# EAGLE design clock_src (EAGLE 7.7.0)
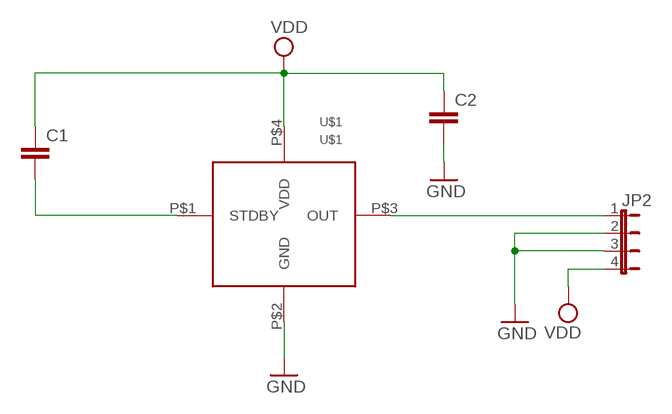
[diagram p0: schematic, sheet 1]

## Parts
C1  C-EUC0603  [C0603]
C2  C-EUC0603  [C0603]
JP2  JP4E  [JP4]
U$1  ASFLMB-24525  [ASFLMB-24525]

## Nets
GND: C2.2 JP2.2 JP2.3 U$1.P$2(GND)
N$1: JP2.1 U$1.P$3(OUT)
N$2: C1.2 U$1.P$1(STDBY)
VDD: C1.1 C2.1 JP2.4 U$1.P$4(VDD)

## Library data of the parts
C1 C2 = resistor:C-EU: CAPACITOR, European symbol
JP2 = jumper:JP4E: JUMPER
U$1 = FM_transmitter:ASFLMB-24525

## Board
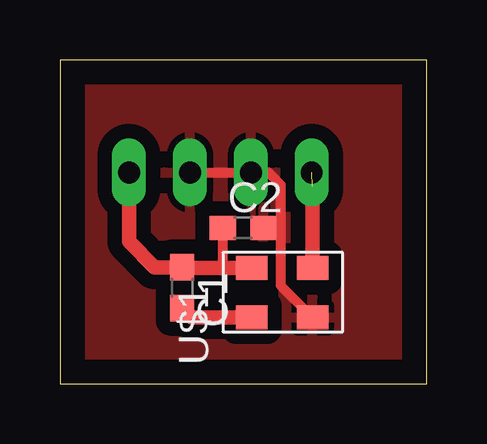
[diagram p1: board, top side]
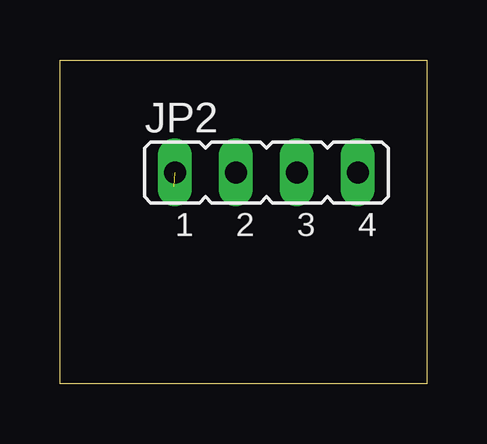
[diagram p2: board, bottom side, seen from below]

Size 15.3 x 13.5 mm. Coordinates in mm from the lower left corner, seen from the top.
Outline: 0,0 15.3,0 15.3,13.5 0,13.5 0,0
Copper layers (1*16): Top 0.035mm / dielectric 1.5mm / Bottom 0.035mm
Design rules "default": minimum track width 10mil, minimum drill 24mil, track to track 8mil, track to pad 8mil, pad to pad 8mil, via to via 8mil, smd to smd 8mil, copper to edge 40mil, drill to drill 8mil, minimum pad ring 10mil, minimum via ring 8mil, stop-mask expansion 4mil, vias tented up to drill 0mil, thermal gap 10mil

### Footprints (pad centres in the part's own frame; a part is rotated, then mirrored left to right if it is on the bottom)
C0603 = smd 1.1 x 1: 1 -0.85,0; 2 0.85,0
JP4 = drill 0.914 long: 1 -3.81,0; 2 -1.27,0; 3 1.27,0; 4 3.81,0
ASFLMB-24525 = smd 1.3 x 1: P$1 0.2,0; P$2 2.74,0; P$3 2.74,2.07; P$4 0.2,2.07

### Placement (x,y rotation side)
C1  5.1,4 270 top
C2  7.64,6.5 0 top
JP2  6.69,8.81 0 bottom
U$1  7.8,2.76 0 top

### Tracks (layer width: path | path; a pad name or v marks a point on that pad's centre or on a via)
GND
  Top 0.406: 9.2,6.5 9.2,8.3 8.69,8.81 JP2.2 JP2.3 | 9.2,6.5 9.2,4.1 U$1.P$2 | C2.2 9.2,6.5
  pour Top (isolate 0.6): 14.2,12.7 0.5,12.7 0.5,0.7 14.2,0.7
N$1  (1 unrouted)
  Top 0.61: 10.54,8.21 U$1.P$3
N$2
  Top 0.61: U$1.P$1 5.49,2.76 C1.2
VDD
  Top 0.406: C2.1 6.79,4.94 6.9,4.83
  Top 0.61: U$1.P$4 6.9,4.83 5.1,4.83 C1.1 3.95,4.85 2.88,5.92 JP2.4